# Altium schematic sheet XMeter.SchDoc
size A3; SheetNumber: 1; SheetTotal: 1
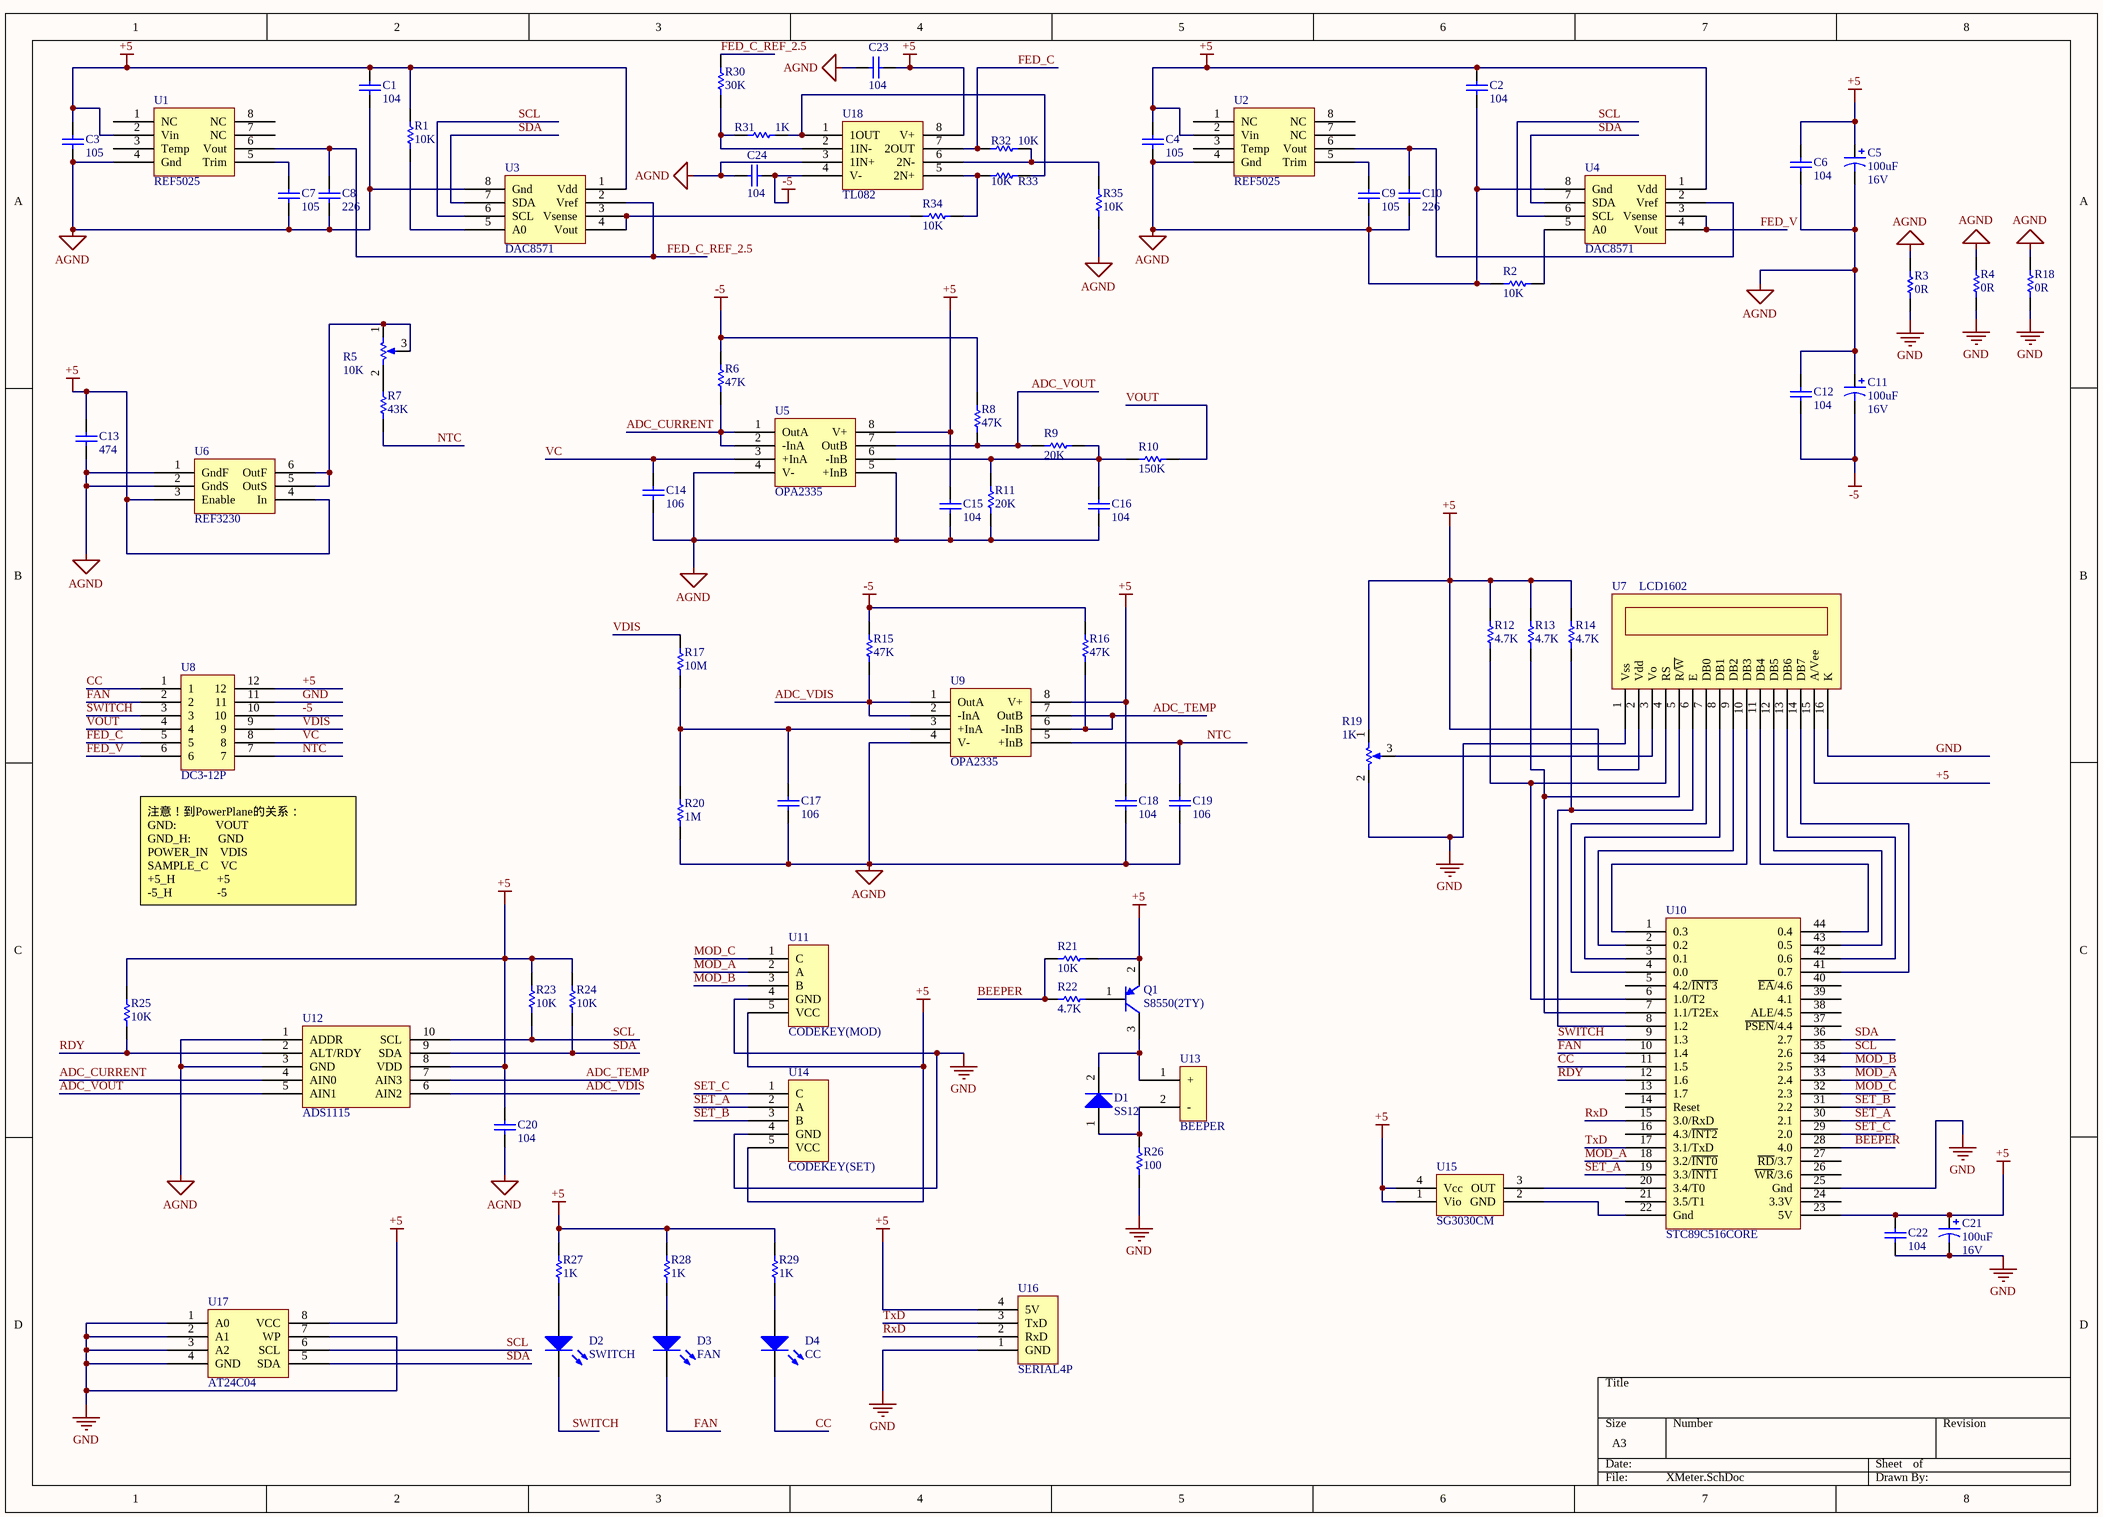
[diagram p0: XMeter.SchDoc]

## Parts
C1  value 104  [CAPC1608L]
C2  value 104  [CAPC1608L]
C3  value 105  [CAPC1608L]
C4  value 105  [CAPC1608L]
C5  16V  value 100uF  [TC6032-2412]
C6  value 104  [CAPC1608L]
C7  value 105  [CAPC1608L]
C8  value 226  [C1206]
C9  value 105  [CAPC1608L]
C10  value 226  [C1206]
C11  16V  value 100uF  [TC6032-2412]
C12  value 104  [CAPC1608L]
C13  value 474  [CAPC1608L]
C14  value 106  [CAPC1608L]
C15  value 104  [CAPC1608L]
C16  value 104  [CAPC1608L]
C17  value 106  [CAPC1608L]
C18  value 104  [CAPC1608L]
C19  value 106  [CAPC1608L]
C20  value 104  [CAPC1608L]
C21  16V  value 100uF  [TC6032-2412]
C22  value 104  [CAPC1608L]
C23  value 104  [CAPC1608L]
C24  value 104  [CAPC1608L]
D1  SS12  [DO214AC SMA]
D2  SWITCH  [LED]
D3  FAN  [LED]
D4  CC  [LED]
Q1  S8550(2TY)  [SOT-23B_L]
R1  value 10K  [RESC1608L]
R2  value 10K  [RESC1608L]
R3  value 0R  [RESC1608L]
R4  value 0R  [RESC1608L]
R5  value 10K  [VR5]
R6  value 47K  [RESC1608L]
R7  value 43K  [RESC1608L]
R8  value 47K  [RESC1608L]
R9  value 20K  [RESC1608L]
R10  value 150K  [RESC1608L]
R11  value 20K  [RESC1608L]
R12  value 4.7K  [RESC1608L]
R13  value 4.7K  [RESC1608L]
R14  value 4.7K  [RESC1608L]
R15  value 47K  [RESC1608L]
R16  value 47K  [RESC1608L]
R17  value 10M  [RESC1608L]
R18  value 0R  [RESC1608L]
R19  value 1K  [VR4]
R20  value 1M  [RESC1608L]
R21  value 10K  [RESC1608L]
R22  value 4.7K  [RESC1608L]
R23  value 10K  [RESC1608L]
R24  value 10K  [RESC1608L]
R25  value 10K  [RESC1608L]
R26  value 100  [RESC1608L]
R27  value 1K  [RESC1608L]
R28  value 1K  [RESC1608L]
R29  value 1K  [RESC1608L]
R30  value 30K  [RESC1608L]
R31  value 1K  [RESC1608L]
R32  value 10K  [RESC1608L]
R33  value 10K  [RESC1608L]
R34  value 10K  [RESC1608L]
R35  value 10K  [RESC1608L]
U1  REF5025  [SOP127P636-8L]
U2  REF5025  [SOP127P636-8L]
U3  DAC8571  [TSOP65P490-8AL]
U4  DAC8571  [TSOP65P490-8AL]
U5  OPA2335  [SOP127P636-8L]
U6  REF3230  [SOT26A-6L]
U7  LCD1602  [LCD1602]
U8  DC3-12P  [DC3-12P]
U9  OPA2335  [SOP127P636-8L]
U10  STC89C516CORE  [STC89516CORE]
U11  CODEKEY(MOD)  [CODEKEY]
U12  ADS1115  [TSSOP50P490-10AL]
U13  BEEPER  [BEEPER]
U14  CODEKEY(SET)  [CODEKEY]
U15  SG3030CM  [SG3030CM]
U16  SERIAL4P  [X254-4P]
U17  AT24C04  [DIP-8]
U18  TL082  [DIP-8]

## Nets
+5: C1.2 C2.2 C3.2 C4.2 C5.1 C6.2 C13.2 C15.2 C18.2 C20.2 C21.1 C22.2 C23.1 Q1.2(E) R1.1 R12.1 R13.1 R14.1 R19.1(TOP) R21.2 R23.1 R24.1 R25.1 R27.2 R28.2 R29.2 U1.2(Vin) U2.2(Vin) U3.1(Vdd) U4.1(Vdd) U5.8(V+) U6.3(Enable) U6.4(In) U7.2(Vdd) U7.15(A/Vee) U8.12 U9.8(V+) U10.23(5V) U11.5(VCC) U12.8(VDD) U14.5(VCC) U15.1(Vio) U15.4(Vcc) U16.4(5V) U17.8(VCC) U18.8(V+)
-5: C11.2 C12.1 C24.1 R6.1 R8.1 R15.1 R16.1 U8.10 U18.4(V-)
AGND: C1.1 C2.1 C3.1 C4.1 C5.2 C6.1 C7.1 C8.2 C9.1 C10.2 C11.1 C12.2 C13.1 C14.1 C15.1 C16.1 C17.1 C18.1 C19.1 C20.1 C23.2 C24.2 R2.2 R3.1 R4.1 R11.2 R18.1 R20.2 R35.2 U1.4(Gnd) U2.4(Gnd) U3.8(Gnd) U4.8(Gnd) U5.4(V-) U5.5(+InB) U6.1(GndF) U6.2(GndS) U9.4(V-) U12.1(ADDR) U12.3(GND) U18.3(1IN+)
GND: C21.2 C22.1 R3.2 R4.2 R18.2 R19.2(BOT) R26.1 U7.1(Vss) U7.16(K) U8.11 U10.25(Gnd) U11.4(GND) U14.4(GND) U16.1(GND) U17.1(A0) U17.2(A1) U17.3(A2) U17.4(GND) U17.7(WP)
ADC_CURRENT: R6.2 U5.1(OutA) U5.2(-InA) U12.4(AIN0)
ADC_TEMP: R16.2 U9.6(-InB) U9.7(OutB) U12.7(AIN3)
ADC_VDIS: R15.2 U9.1(OutA) U9.2(-InA) U12.6(AIN2)
ADC_VOUT: R8.2 R9.1 U5.7(OutB) U12.5(AIN1)
BEEPER: R21.1 R22.1 U10.28(4.0)
CC: D4.2(K) U8.1 U10.11(1.5)
FAN: D3.2(K) U8.2 U10.10(1.4)
FED_C: R32.1 U8.5 U18.7(2OUT)
FED_C_REF_2.5: C8.1 R30.2 U1.6(Vout) U3.2(Vref)
FED_V: U4.3(Vsense) U4.4(Vout) U8.6
MOD_A: U10.18(3.2/~{INT0}) U10.33(2.4) U11.2(A)
MOD_B: U10.34(2.5) U11.3(B)
MOD_C: U10.32(2.3) U11.1(C)
NTC: C19.2 R7.2 U8.7 U9.5(+InB)
RDY: R25.2 U10.12(1.6) U12.2(ALT/RDY)
RxD: U10.15(3.0/RxD) U16.2(RxD)
SCL: R23.2 U3.6(SCL) U4.6(SCL) U10.35(2.6) U12.10(SCL) U17.6(SCL)
SDA: R24.2 U3.7(SDA) U4.7(SDA) U10.36(2.7) U12.9(SDA) U17.5(SDA)
SET_A: U10.19(3.3/~{INT1}) U10.30(2.1) U14.2(A)
SET_B: U10.31(2.2) U14.3(B)
SET_C: U10.29(2.0) U14.1(C)
SWITCH: D2.2(K) U8.3 U10.9(1.3)
TxD: U10.17(3.1/TxD) U16.3(TxD)
VC: C14.2 U5.3(+InA) U8.8
VDIS: R17.1 U8.9
VOUT: R10.2 U8.4
NetC7_2: C7.2 U1.5(Trim)
NetC9_2: C9.2 U2.5(Trim)
NetC10_1: C10.1 U2.6(Vout) U4.2(Vref)
NetC16_2: C16.2 R9.2 R10.1 R11.1 U5.6(-InB)
NetC17_2: C17.2 R17.2 R20.1 U9.3(+InA)
NetD1_1: D1.1(A) R26.2 U13.2(-)
NetD1_2: D1.2(K) Q1.3(C) U13.1(+)
NetD2_1: D2.1(A) R27.1
NetD3_1: D3.1(A) R28.1
NetD4_1: D4.1(A) R29.1
NetQ1_1: Q1.1(B) R22.2
NetR1_2: R1.2 U3.5(A0)
NetR2_1: R2.1 U4.5(A0)
NetR5_1: R5.1(TOP) R5.3(TAP) U6.5(OutS) U6.6(OutF)
NetR5_2: R5.2(BOT) R7.1
NetR12_2: R12.2 U7.4(RS) U10.6(1.0/T2)
NetR13_2: R13.2 U7.5(R/~{W}) U10.7(1.1/T2Ex)
NetR14_2: R14.2 U7.6(E) U10.8(1.2)
NetR19_3: R19.3(TAP) U7.3(Vo)
NetR30_1: R30.1 R31.1 U18.2(1IN-)
NetR31_2: R31.2 R33.2 U18.1(1OUT)
NetR32_2: R32.2 R35.1 U18.6(2N-)
NetR33_1: R33.1 R34.2 U18.5(2N+)
NetR34_1: R34.1 U3.3(Vsense) U3.4(Vout)
NetU7_7: U7.7(DB0) U10.4(0.0)
NetU7_8: U7.8(DB1) U10.3(0.1)
NetU7_9: U7.9(DB2) U10.2(0.2)
NetU7_10: U7.10(DB3) U10.1(0.3)
NetU7_11: U7.11(DB4) U10.44(0.4)
NetU7_12: U7.12(DB5) U10.43(0.5)
NetU7_13: U7.13(DB6) U10.42(0.6)
NetU7_14: U7.14(DB7) U10.41(0.7)
NetU10_20: U10.20(3.4/T0) U15.3(OUT)
NetU10_22: U10.22(Gnd) U15.2(GND)

Not connected (* = marked no-connect by the designer): U1 1(NC) 3(Temp) 7(NC) 8(NC); U2 1(NC) 3(Temp) 7(NC) 8(NC); U10 5(4.2/~{INT3}) 13(1.7) 14(Reset) 16(4.3/~{INT2}) 21(3.5/T1) 24(3.3V) 26(~{WR}/3.6) 27(~{RD}/3.7) 37(~{PSEN}/4.4) 38(ALE/4.5) 39(4.1) 40(~{EA}/4.6)

## Notes on the sheet
- (near U8) 注意！到PowerPlane的关系：
  GND:             VOUT
  GND_H:         GND
  POWER_IN    VDIS
  SAMPLE_C    VC
  +5_H              +5
  -5_H               -5

## Library data of the parts
C1-C4 C6-C10 C12-C20 C22-C24 = Cap: Capacitor; Published: 8-Jun-2000; LatestRevisionDate: 17-Jul-2002; LatestRevisionNote: Re-released for DXP Platform.; PackageReference: RAD-0.3; Publisher: Altium Limited; PackageDescription: Radial Cap, Thru-Hole; 2 Leads; 0.3 in Pin Spacing
C5 C11 C21 = Cap Pol1: Polarized Capacitor (Radial); Published: 8-Jun-2000; LatestRevisionDate: 17-Jul-2002; LatestRevisionNote: Re-released for DXP Platform.; PackageReference: RB7.6-15; Publisher: Altium Limited; PackageDescription: Polarized Capacitor (Radial); 2 Leads
D1 = Diode 1N4007: 1 Amp General Purpose Rectifier; Published: 8-Jun-2000; LatestRevisionDate: 17-Jul-2002; LatestRevisionNote: Re-released for DXP Platform.; DatasheetVersion: 1998; PackageVersion: Aug-1999; PackageReference: DO-41; Publisher: Altium Limited; PackageDescription: Diode, Axial; Body 5.2 x 2.7 mm (LxDia. max), Lead Dia. 0.86 mm (max); Code_JEDEC: DO-204-AL; ComponentLink1Description: Manufacturer Link; ComponentLink1URL: http://www.fairchildsemi.com/; ComponentLink2Description: Datasheet; ComponentLink2URL: http://www.fairchildsemi.com/ds/1N%2F1N4001.pdf
D2-D4 = LED1: Typical RED GaAs LED; Published: 8-Jun-2000; LatestRevisionDate: 08-Jul-2005; LatestRevisionNote: Mech Layer 1 removed.; PackageReference: LED-1; Publisher: Altium Limited; PackageDescription: LED; 2 Leads
Q1 = PNP: PNP Bipolar Transistor; Published: 8-Jun-2000; LatestRevisionDate: 29-May-2009; LatestRevisionNote: IPC-7351 Footprint Added.; PackageVersion: Aug-1999; PackageReference: SOT-23B; Publisher: Altium Limited; PackageDescription: 3-Pin SOT-23 Package 0.95 mm Pitch, 2.4 mm Lead Span
R1-R4 R6-R18 R20-R35 = Res1: Resistor; Published: 8-Jun-2000; LatestRevisionDate: 17-Jul-2002; LatestRevisionNote: Re-released for DXP Platform.; PackageReference: AXIAL-0.3; Publisher: Altium Limited; PackageDescription: Axial Device, Thru-Hole; 2 Leads; 0.3 in Pin Spacing
R5 R19 = RPot: Potentiometer; Sim Note: Enter the Resistance value and the set point into parameter fields.; Set Position: 0.5; Published: 8-Jun-2000; LatestRevisionDate: 17-Jul-2002; LatestRevisionNote: Re-released for DXP Platform.; PackageReference: VR5; Publisher: Altium Limited; PackageDescription: Variable Resistor, Thru-Hole; 3 Leads
U11 U14 = CODEKEY